# EAGLE design Laser_Teensy4 (EAGLE 9.6.2)

## Sheet 1 of 2
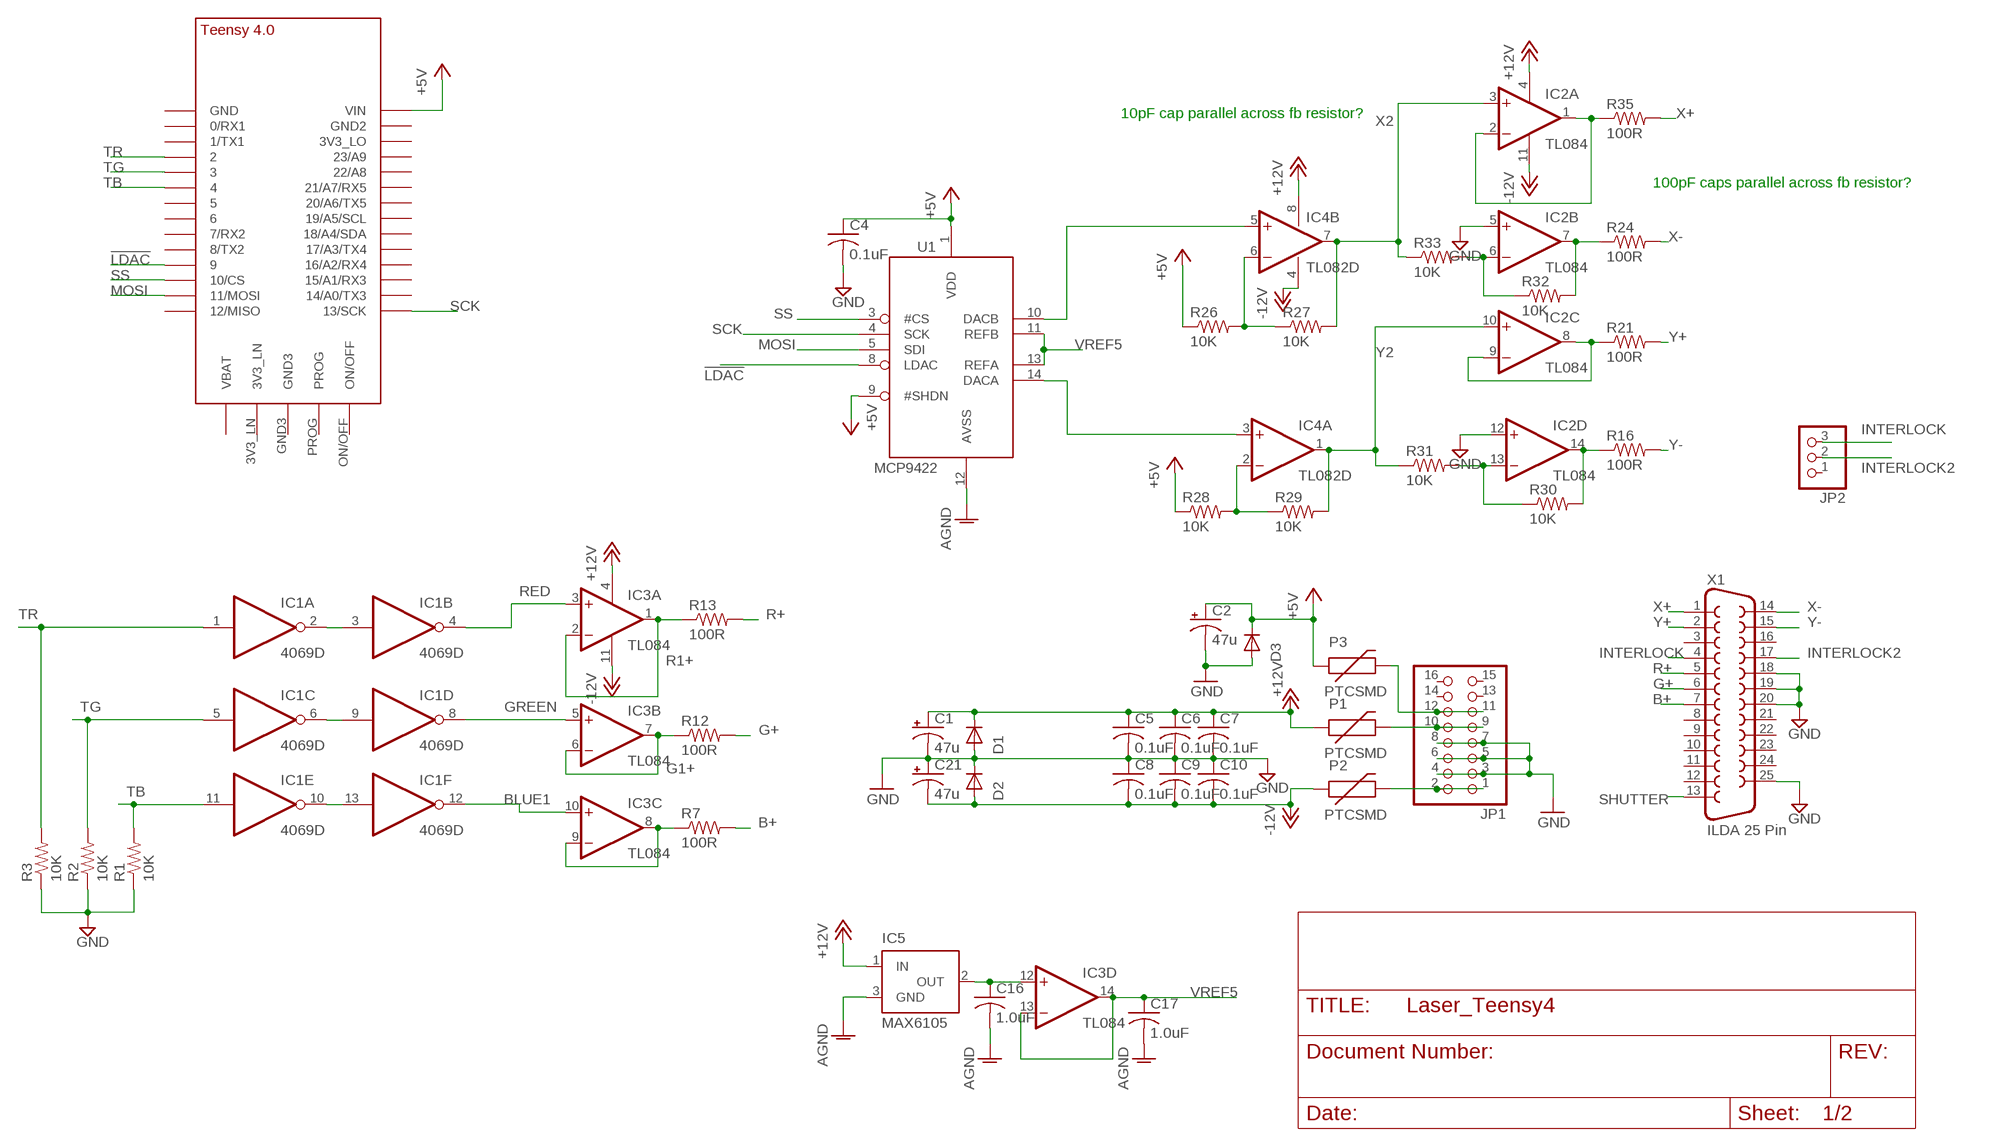
[diagram p0: schematic, sheet 1]

### Parts
C1  47u  CPOL-USD  [PANASONIC_D]
C2  47u  CPOL-USD  [PANASONIC_D]
C4  0.1uF  C-USC0603  [C0603]
C5  0.1uF  C-USC0603  [C0603]
C6  0.1uF  C-USC0603  [C0603]
C7  0.1uF  C-USC0603  [C0603]
C8  0.1uF  C-USC0603  [C0603]
C9  0.1uF  C-USC0603  [C0603]
C10  0.1uF  C-USC0603  [C0603]
C16  1.0uF  C-US025-024X044  [C025-024X044]
C17  1.0uF  C-US025-024X044  [C025-024X044]
C21  47u  CPOL-USD  [PANASONIC_D]
D1  1N5819HW  DIODE-SOD123  [SOD123]
D2  1N5819HW  DIODE-SOD123  [SOD123]
D3  1N5819HW  DIODE-SOD123  [SOD123]
IC1  4069D  [SO14]
IC2  TL084  [SOIC-14]
IC3  TL084  [SOIC-14]
IC4  TL082D  [SO08]
IC5  MAX6105  MAX6520  [SOT23]
JP1  PINHD-2X8  [2X08]
JP2  PINHD-1X3  [1X03]
P1  PTCSMD  [PTC-1206]
P2  PTCSMD  [PTC-1206]
P3  PTCSMD  [PTC-1206]
R1  10K  R-US_R0603  [R0603]
R2  10K  R-US_R0603  [R0603]
R3  10K  R-US_R0603  [R0603]
R7  100R  R-US_R0603  [R0603]
R12  100R  R-US_R0603  [R0603]
R13  100R  R-US_R0603  [R0603]
R16  100R  R-US_R0603  [R0603]
R21  100R  R-US_R0603  [R0603]
R24  100R  R-US_R0603  [R0603]
R26  10K  R-US_R0603  [R0603]
R27  10K  R-US_R0603  [R0603]
R28  10K  R-US_R0603  [R0603]
R29  10K  R-US_R0603  [R0603]
R30  10K  R-US_R0603  [R0603]
R31  10K  R-US_R0603  [R0603]
R32  10K  R-US_R0603  [R0603]
R33  10K  R-US_R0603  [R0603]
R35  100R  R-US_R0603  [R0603]
U1  MCP4922  [SOIC-14]
U$1  TEENSY_4.0  [TEENSY_4.0]
X1  ILDA 25 Pin  F25D  [F25D]

### Nets
!LDAC: U1.8(LDAC) U$1.9/CS
+5V [power]: C2.+ C4.1 D3.C P3.1 R26.1 R28.1 U1.1(VDD) U1.9(#SHDN) U$1.VIN
+12V [power]: C1.+ C5.1 C6.1 C7.1 D1.C IC2.4(A:V+) IC3.4(A:V+) IC4.8(P:V+) IC5.1(IN) P1.1
-12V [power]: C8.2 C9.2 C10.2 C21.- D2.A IC2.11(A:V-) IC3.11(A:V-) IC4.4(P:V-) P2.1
AGND: C16.2 C17.2 IC5.3(GND) U1.12(AVSS)
B1+: IC3.8(C:OUT) IC3.9(C:-IN) R7.1
B+: R7.2 X1.7
BLUE1: IC1.12(F:O) IC3.10(C:+IN)
G1+: IC3.6(B:-IN) IC3.7(B:OUT) R12.1
G+: R12.2 X1.6
GND: C1.- C2.- C4.2 C5.2 C6.2 C7.2 C8.1 C9.1 C10.1 C21.+ D1.A D2.C D3.A IC2.5(B:+IN) IC2.12(D:+IN) JP1.3 JP1.4 JP1.5 JP1.6 JP1.7 JP1.8 R1.1 R2.1 R3.1 X1.18 X1.19 X1.20 X1.25 ; also sheet 2
GREEN: IC1.8(D:O) IC3.5(B:+IN)
INTERLOCK: JP2.3 X1.4
INTERLOCK2: JP2.2 X1.17
MOSI: U1.5(SDI) U$1.11/MOSI
N$1: IC1.2(A:O) IC1.3(B:I)
N$2: IC1.6(C:O) IC1.9(D:I)
N$3: IC1.10(E:O) IC1.13(F:I)
N$7: JP1.1 JP1.2 P2.2
N$8: JP1.9 JP1.10 P1.2
N$10: JP1.11 JP1.12 P3.2
N$24: IC4.5(B:+IN) U1.10(DACB)
N$25: C16.1 IC3.12(D:+IN) IC5.2(OUT)
N$30: IC4.6(B:-IN) R26.2 R27.1
N$31: IC4.2(A:-IN) R28.2 R29.1
N$33: IC4.3(A:+IN) U1.14(DACA)
N$35: IC2.6(B:-IN) R32.1 R33.2
N$36: IC2.13(D:-IN) R30.1 R31.2
R1+: IC3.1(A:OUT) IC3.2(A:-IN) R13.1
R+: R13.2 X1.5
RED: IC1.4(B:O) IC3.3(A:+IN)
SCK: U1.4(SCK) U$1.13/SCK
SHUTTER: X1.13
SS: U1.3(#CS) U$1.10/CS
TB: IC1.11(E:I) R1.2 U$1.4/CANRX
TG: IC1.5(C:I) R2.2 U$1.3/CANTX
TR: IC1.1(A:I) R3.2 U$1.2
VREF5 [power]: C17.1 IC3.13(D:-IN) IC3.14(D:OUT) U1.11(REFB) U1.13(REFA)
X1+: IC2.1(A:OUT) IC2.2(A:-IN) R35.1
X1-: IC2.7(B:OUT) R24.1 R32.2
X2: IC2.3(A:+IN) IC4.7(B:OUT) R27.2 R33.1
X+: R35.2 X1.1
X-: R24.2 X1.14
Y1+: IC2.8(C:OUT) IC2.9(C:-IN) R21.1
Y1-: IC2.14(D:OUT) R16.1 R30.2
Y2: IC2.10(C:+IN) IC4.1(A:OUT) R29.2 R31.1
Y+: R21.2 X1.2
Y-: R16.2 X1.15
Unconnected: JP1.13 JP1.14 JP1.15 JP1.16 JP2.1 U$1.0/RX(0/RX1) U$1.1/TX(1/TX1) U$1.3V3_LN U$1.3V3_LO U$1.5 U$1.6 U$1.7(7/RX2) U$1.8(8/TX2) U$1.12/MISO U$1.14/A0(14/A0/TX3) U$1.15/A1(15/A1/RX3) U$1.16/A2(16/A2/RX4) U$1.17/A3(17/A3/TX4) U$1.18/A4/SDA U$1.19/A5/SCL U$1.20/A6(20/A6/TX5) U$1.21/A7(21/A7/RX5) U$1.22/A8 U$1.23/A9 U$1.GND U$1.GND2 U$1.GND3 U$1.ON/OFF U$1.PROG U$1.VBAT\(VBAT) X1.3 X1.8 X1.9 X1.10 X1.11 X1.12 X1.16 X1.21 X1.22 X1.23 X1.24

### Notes on the sheet
- 10pF cap parallel across fb resistor?
- 100pF caps parallel across fb resistor?

## Sheet 2 of 2
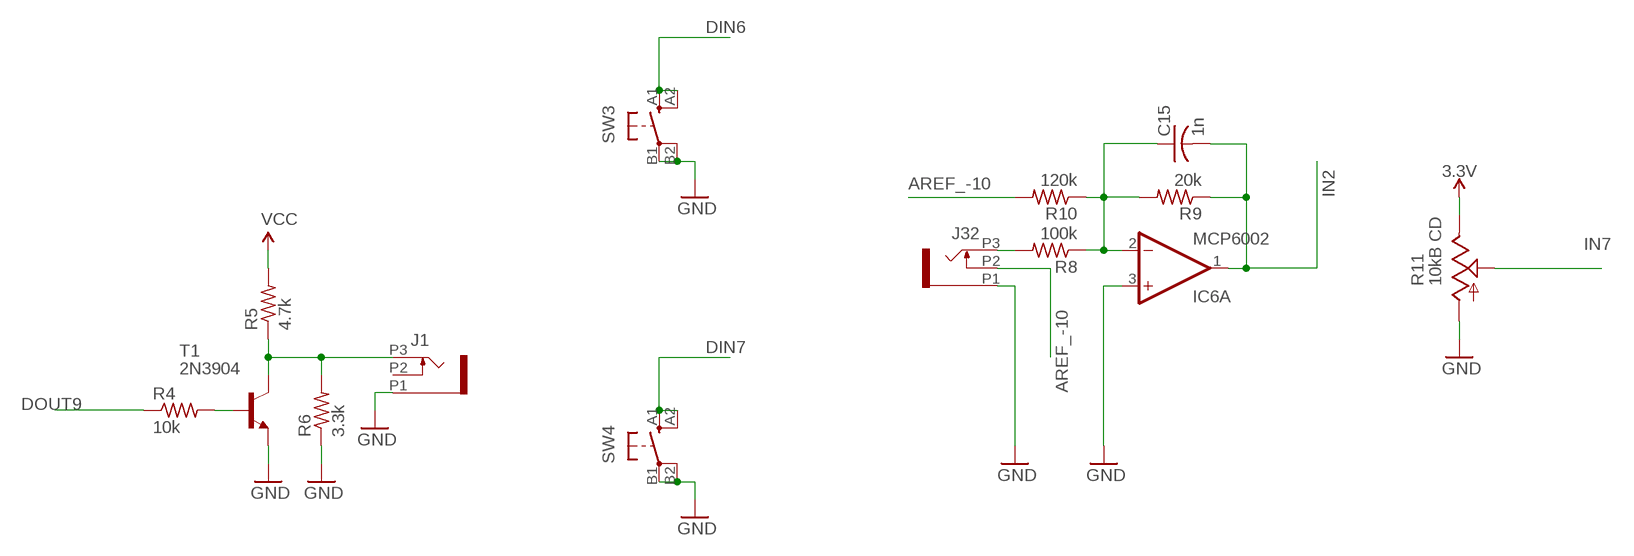
[diagram p1: schematic, sheet 2]

### Parts
C15  1n  C-US050-025X075  [C050-025X075]
IC6  MCP6002  TL072D  [SO08]
J1  PJ301_THONKICONN6  [WQP_PJ_301M6]
J32  PJ301_THONKICONN6  [WQP_PJ_301M6]
R4  10k  R-US_0204/7  [0204/7]
R5  4.7k  R-US_0204/7  [0204/7]
R6  3.3k  R-US_0204/7  [0204/7]
R8  100k  R-US_0204/7  [0204/7]
R9  20k  R-US_0204/7  [0204/7]
R10  120k  R-US_0204/7  [0204/7]
R11  10kB CD  POT_USVERTICAL_PS  [ALPS_POT_VERTICAL_PS]
SW3  D6R  [D6R]
SW4  D6R  [D6R]
T1  2N3904  [TO92]

### Nets
3.3V [+3V3]: R11.P$1(E)
AREF_-10 [-10V]: J32.P2 R10.2
DIN6: SW3.A1(S) SW3.A2(S1)
DIN7: SW4.A1(S) SW4.A2(S1)
DOUT9: R4.1
GND: IC6.3(A:+IN) J1.P1 J32.P1 R6.1 R11.P$3(A) SW3.B1(P) SW3.B2(P1) SW4.B1(P) SW4.B2(P1) T1.3(E) ; also sheet 1
IN2: C15.2 IC6.1(A:OUT) R9.1
IN7: R11.P$2(S)
N$4: R4.2 T1.2(B)
N$5: J1.P3 R5.1 R6.2 T1.1(C)
N$6: C15.1 IC6.2(A:-IN) R8.1 R9.2 R10.1
N$34: J32.P3 R8.2
VCC [VCC]: R5.2
Unconnected: IC6.5(B:+IN) IC6.6(B:-IN) IC6.7(B:OUT) J1.P2

## Power pins joined to a net without a drawn wire
+5V: IC1.14(P:VDD)
V+: IC6.8(P:V+)
V-: IC6.4(P:V-)
VSS: IC1.7(P:VSS)

## Library data of the parts
C1 C2 C21 = rcl:CPOL-US: POLARIZED CAPACITOR, American symbol
C4-C10 C16 C17 = adafruit:C-US: CAPACITOR, American symbol
C15 = rcl:C-US: CAPACITOR, American symbol; SPICEPREFIX: C
D1-D3 = diode:DIODE-: DIODE
IC1 = 40xx:4069: Hex INVERTER
IC2 IC3 = favreau:TL084: Texas Instruments TL084 JFET General Purpose Op-Amp
IC4 = linear:TL082: OP AMP
IC5 = maxim:MAX6520: 1.2V Voltage Reference 50ppm/°C, SOT23, 3-Terminal Source: http://datasheets.maxim-ic.com/en/ds/MAX6520.pdf
IC6 = linear:TL072: OP AMP
J1 J32 = og-pj301_variations:PJ301_THONKICONN
JP1 = pinhead:PINHD-2X8: PIN HEADER
JP2 = pinhead:PINHD-1X3: PIN HEADER
P1-P3 = SparkFun:PTC: Resettable Fuse PTC Resettable Fuse. Spark Fun Electronics SKU : COM-08357
R1-R3 R7 R12 R13 R16 R21 R24 R26-R33 R35 = resistor:R-US_: RESISTOR, American symbol
R4-R6 R8-R10 = rcl:R-US_: RESISTOR, American symbol; SPICEPREFIX: R
R11 = pot-alps:POT_US
SW3 SW4 = og-switch:D6R: C&K D6R
T1 = transistor:2N3904: NPN TRANSISTOR
U1 = favreau:MCP4922
U$1 = TEENSY 4.0:TEENSY_4.0
X1 = SparkFun:F25: D-SUB 25 25 Pin male connector. PCB edge mount for regular PCB thicknesses. This connector will connect directly to the back of a PC parallel port or through a normal DB25 extension cable (M/F). SKU: PRT-08287

## Net classes
0 default: width 0.203 mm, clearance 0.203 mm
1 power: width 0.305 mm, clearance 0.203 mm
2 +3V3: width 0.356 mm, clearance 0.152 mm to class 0, clearance 0.254 mm
3 -10V: width 0.356 mm, clearance 0.152 mm to class 0, clearance 0.254 mm
4 VCC: width 0.457 mm, clearance 0.152 mm to class 0, clearance 0.254 mm

## Board
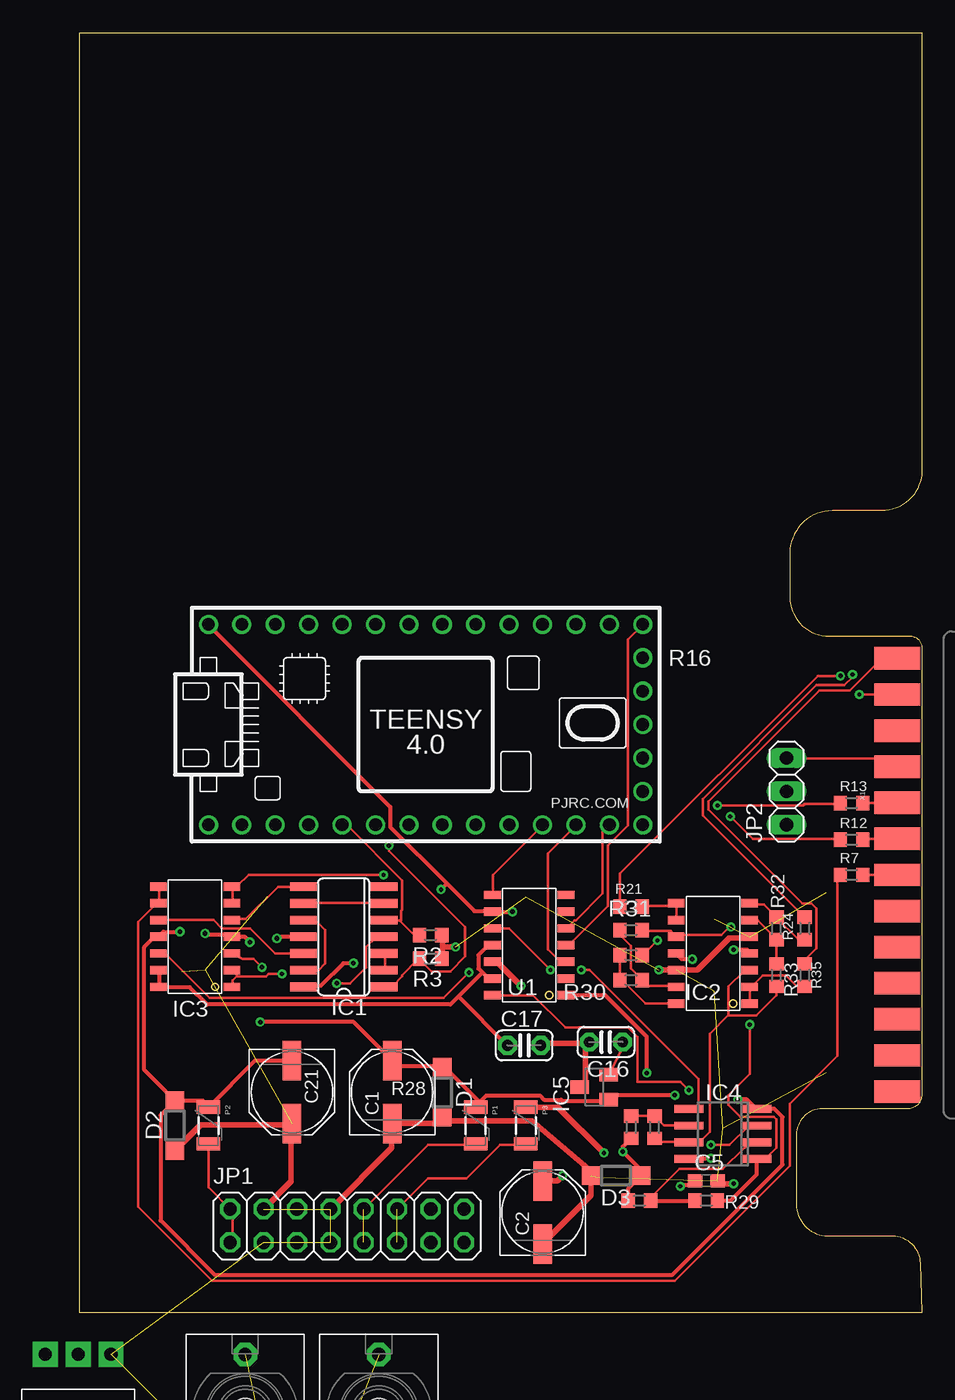
[diagram p2: board, top side]
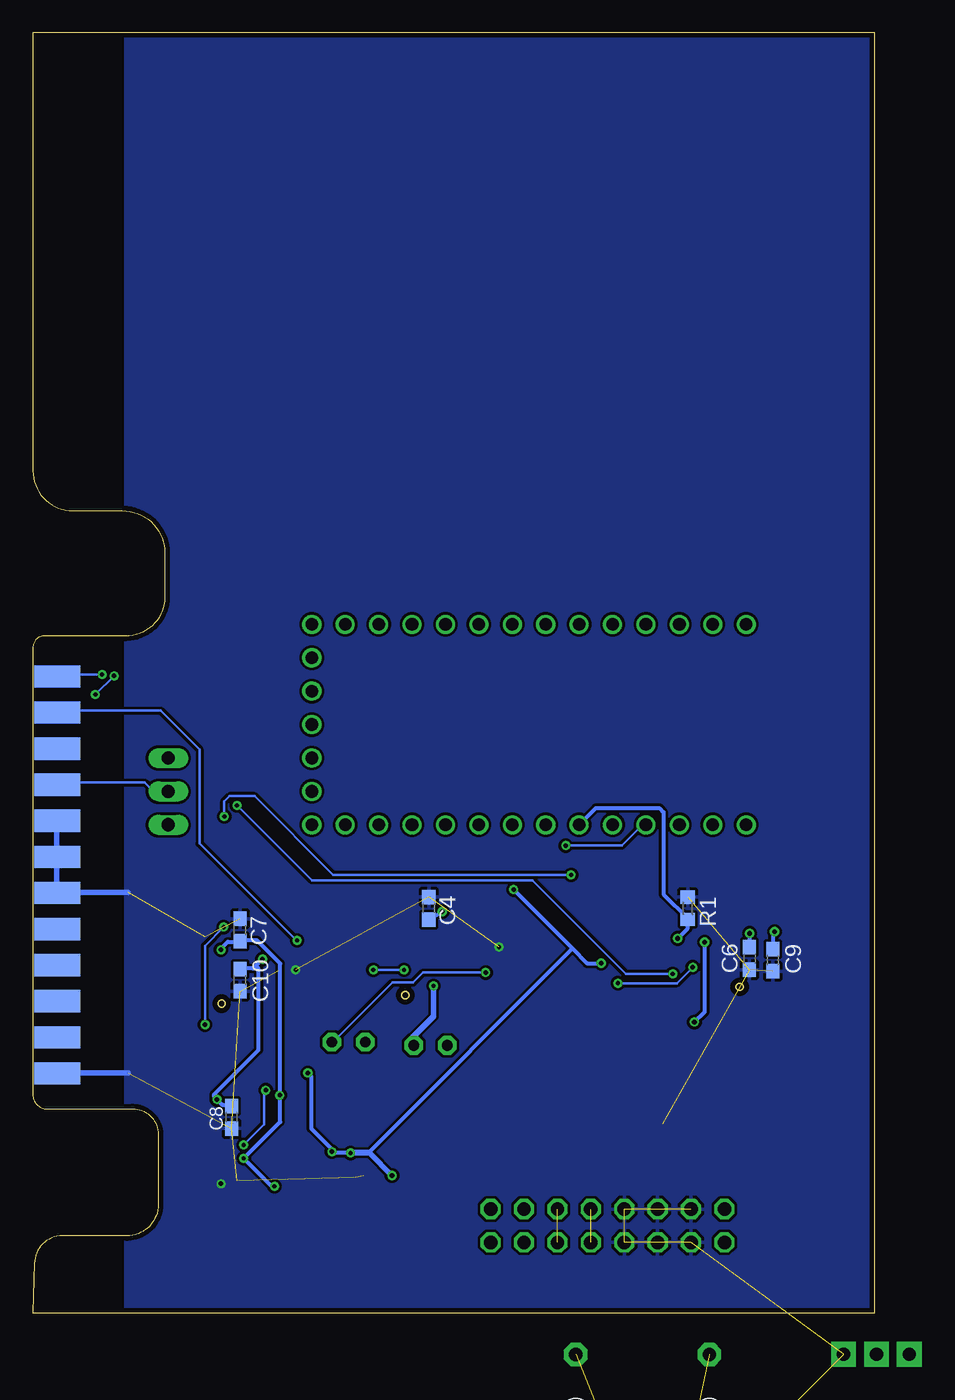
[diagram p3: board, bottom side, seen from below]

Size 64.01 x 97.28 mm. Coordinates in mm from the lower left corner, seen from the top.
Outline: 0,97.28 64.01,97.28 64.01,63.99 arc-90 60.97,60.96 57.2,60.96 arc90 53.97,57.73 53.97,54.42 arc90 56.96,51.44 63.14,51.44 arc-90 64.01,50.57 64.01,16.57 arc-90 62.93,15.49 56.43,15.49 arc90 54.48,13.55 54.48,8.22 arc90 56.86,5.84 61.78,5.84 arc-90 63.89,3.74 64.01,0 0,0 0,97.28
Copper layers (1*16): Top 0.0356mm / dielectric 1.5011mm / Bottom 0.0356mm
Design rules "LaenPCBOrder": minimum track width 6mil, minimum drill 13mil, track to track 6mil, track to pad 6mil, pad to pad 6mil, via to via 6mil, smd to smd 6mil, copper to edge 15mil, drill to drill 6mil, minimum pad ring 7mil, minimum via ring 7mil, stop-mask expansion 4mil, vias tented up to drill 0mil, thermal gap 10mil

### Footprints (pad centres in the part's own frame; a part is rotated, then mirrored left to right if it is on the bottom)
PANASONIC_D = smd 3 x 1.4: + 2.4,0; - -2.4,0
C0603 = smd 1.1 x 1: 1 -0.85,0; 2 0.85,0
C050-025X075 = drill 0.813 octagon: 1 -2.54,0; 2 2.54,0
C025-024X044 = drill 0.813 pad 1.422 octagon: 1 -1.27,0; 2 1.27,0
SOD123 = smd 1.4 x 1.4: A 1.9,0; C -1.9,0
SO14 = smd 0.66 x 2.032: 1 -3.81,-3.073; 2 -2.54,-3.073; 3 -1.27,-3.073; 4 0,-3.073; 5 1.27,-3.073; 6 2.54,-3.073; 7 3.81,-3.073; 8 3.81,3.073; 9 2.54,3.073; 10 1.27,3.073; 11 0,3.073; 12 -1.27,3.073; 13 -2.54,3.073; 14 -3.81,3.073
SOIC-14 = smd 1.27 x 0.635: 1 -0.762,-0.508; 2 -0.762,-1.778; 3 -0.762,-3.048; 4 -0.762,-4.318; 5 -0.762,-5.588; 6 -0.762,-6.858; 7 -0.762,-8.128; 8 4.826,-8.128; 9 4.826,-6.858; 10 4.826,-5.588; 11 4.826,-4.318; 12 4.826,-3.048; 13 4.826,-1.778; 14 4.826,-0.508
SO08 = smd 0.6 x 2.2: 1 -1.905,-2.6; 2 -0.635,-2.6; 3 0.635,-2.6; 4 1.905,-2.6; 5 1.905,2.6; 6 0.635,2.6; 7 -0.635,2.6; 8 -1.905,2.6
SOT23 = smd 1 x 1.4: 1 -0.95,-1.1; 2 0.95,-1.1; 3 0,1.1
WQP_PJ_301M6 = drill 1.016 pad 1.778 octagon: P1 0,-5.715; P2 0,-3.175; P3 0,4.445 | hole 2.2: 0,0
2X08 = drill 1.016 octagon: 1 -8.89,-1.27; 2 -8.89,1.27; 3 -6.35,-1.27; 4 -6.35,1.27; 5 -3.81,-1.27; 6 -3.81,1.27; 7 -1.27,-1.27; 8 -1.27,1.27; 9 1.27,-1.27; 10 1.27,1.27; 11 3.81,-1.27; 12 3.81,1.27; 13 6.35,-1.27; 14 6.35,1.27; 15 8.89,-1.27; 16 8.89,1.27
1X03 = drill 1.016 long: 1 -2.54,0; 2 0,0; 3 2.54,0
PTC-1206 = smd 1 x 1.8: 1 -1.4,0; 2 1.4,0
R0603 = smd 1 x 1.1: 1 -0.85,0; 2 0.85,0
0204/7 = drill 0.813 octagon: 1 -3.81,0; 2 3.81,0
ALPS_POT_VERTICAL_PS = drill 1 pad 1.88 square: P$1 -2.5,7; P$2 0,7; P$3 2.5,7 | drill 1.5 pad 2.54 octagon: P$4 -4.7,0; P$5 4.7,0
D6R = drill 1.1 pad 1.93: A1 -2.5,2.5; A2 2.5,2.5; B1 -2.5,-2.5; B2 2.5,-2.5
TO92 = drill 0.813 octagon: 1 1.27,0; 2 0,1.905; 3 -1.27,0
TEENSY_4.0 = drill 0.965: 0/RX -13.97,-7.62; 1/TX -11.43,-7.62; 2 -8.89,-7.62; 3/CANTX -6.35,-7.62; 3V3_LN 16.51,-2.54; 3V3_LO -11.43,7.62; 4/CANRX -3.81,-7.62; 5 -1.27,-7.62; 6 1.27,-7.62; 7 3.81,-7.62; 8 6.35,-7.62; 9/CS 8.89,-7.62; 10/CS 11.43,-7.62; 11/MOSI 13.97,-7.62; 12/MISO 16.51,-7.62; 13/SCK 16.51,7.62; 14/A0 13.97,7.62; 15/A1 11.43,7.62; 16/A2 8.89,7.62; 17/A3 6.35,7.62; 18/A4/SDA 3.81,7.62; 19/A5/SCL 1.27,7.62; 20/A6 -1.27,7.62; 21/A7 -3.81,7.62; 22/A8 -6.35,7.62; 23/A9 -8.89,7.62; GND -16.51,-7.62; GND2 -13.97,7.62; GND3 16.51,0; ON/OFF 16.51,5.08; PROG 16.51,2.54; VBAT\ 16.51,-5.08; VIN -16.51,7.62
F25D = smd 1.7 x 3.5: 1 -16.459,-6.045; 2 -13.716,-6.045; 3 -10.973,-6.045; 4 -8.23,-6.045; 5 -5.486,-6.045; 6 -2.743,-6.045; 7 0,-6.045; 8 2.743,-6.045; 9 5.486,-6.045; 10 8.23,-6.045; 11 10.973,-6.045; 12 13.716,-6.045; 13 16.459,-6.045 | smd 1.7 x 3.5 bottom: 14 -15.088,-6.045; 15 -12.344,-6.045; 16 -9.601,-6.045; 17 -6.858,-6.045; 18 -4.115,-6.045; 19 -1.372,-6.045; 20 1.372,-6.045; 21 4.115,-6.045; 22 6.858,-6.045; 23 9.601,-6.045; 24 12.344,-6.045; 25 15.088,-6.045

### Placement (x,y rotation side)
C1  23.75,16.76 90 top
C2  35.18,7.62 90 top
C4  33.91,30.73 90 bottom
C5  47.62,10.03 0 top
C6  9.52,26.92 270 bottom
C7  48.26,29.08 90 bottom
C8  48.89,14.86 90 bottom
C9  7.75,26.8 90 bottom
C10  48.26,25.27 90 bottom
C15  10.03,-33.02 0 top  (outside the outline)
C16  40,20.57 180 top
C17  33.78,20.32 0 top
C21  16.13,16.76 270 top
D1  27.56,16.76 270 top
D2  7.24,14.22 90 top
D3  40.77,10.41 180 top
IC1  20.07,28.58 90 top
IC2  50.16,22.99 180 top
IC3  10.79,24.26 180 top
IC4  48.89,13.59 90 top
IC5  39.12,17.14 90 top
IC6  -0.13,-38.1 0 top  (outside the outline)
J1  12.57,-7.62 0 top  (outside the outline)
J32  22.73,-7.62 0 top  (outside the outline)
JP1  20.32,6.6 0 top
JP2  53.72,39.62 90 top
P1  30.1,14.22 270 top
P2  9.78,14.22 270 top
P3  33.91,14.22 270 top
R1  14.22,30.73 270 bottom
R2  26.67,28.7 180 top
R3  26.67,26.92 180 top
R4  -0.13,-45.72 0 top  (outside the outline)
R5  10.03,-45.72 0 top  (outside the outline)
R6  20.19,-45.72 0 top  (outside the outline)
R7  58.67,33.27 0 top
R8  -0.13,-50.8 0 top  (outside the outline)
R9  10.03,-50.8 0 top  (outside the outline)
R10  20.19,-50.8 0 top  (outside the outline)
R11  -0.13,-10.16 0 top  (outside the outline)
R12  58.67,35.94 0 top
R13  58.67,38.73 0 top
R16  41.91,27.18 0 top
R21  41.91,30.86 180 top
R24  55.12,29.21 90 top
R26  41.91,14.1 90 top
R27  43.69,14.1 270 top
R28  42.54,8.51 0 top
R29  47.62,8.51 0 top
R30  41.91,25.27 180 top
R31  41.91,29.08 180 top
R32  52.96,29.21 90 top
R33  52.96,25.65 90 top
R35  55.12,25.65 90 top
SW3  2.41,-22.86 0 top  (outside the outline)
SW4  17.65,-22.86 0 top  (outside the outline)
T1  17.65,-33.02 0 top  (outside the outline)
U1  36.2,23.62 180 top
U$1  26.29,44.7 0 top
X1  68.2,33.27 270 top

### Tracks (layer width: path | path; a pad name or v marks a point on that pad's centre or on a via)
!LDAC
  Top 0.203: U1.8 31.42,31.75 31.42,33.27 35.18,37.03 U$1.9/CS
+5V  (via drill 0.33, 0.35)
  Top 0.305: 41.51,8.69 R28.1 41.7,9.44 D3.C 42.67,10.85 v41.27,12.24 41.27,12.61 R26.1 | U1.1 39.95,24.13 43.1,20.98 v43.1,18.21 | 33.96,15.6 P3.1 | 27.92,32.61 23.6,36.93 23.6,38.46 9.78,52.27 U$1.VIN | 27.92,32.61 30,30.53 31.32,30.53 U1.9 v32.89,30.48 | v20.8,26.57 20.04,26.57 18.31,24.84 16.99,24.84 IC1.14 | 27.92,32.61 v27.46,32.16
  Top 0.406: v36.7,10.41 36.31,10.02 C2.+ | P3.1 36.37,15.62 v39.85,12.14
  Bottom 0.305: v43.1,18.21 42.85,17.96 42.85,14.02 41.17,12.34 v41.27,12.24 41.17,12.14 v39.85,12.14 39.75,12.24 38.43,12.24 22.99,27.69 | v20.8,26.57 21.87,26.57 22.99,27.69 | v27.46,32.16 22.99,27.69 | v32.89,30.48 C4.1
  Bottom 0.406: v39.85,12.14 38.43,12.14 v36.7,10.41
+12V  (via drill 0.33, 0.35)
  Top 0.305: v49.71,27.58 50.72,27.58 50.93,27.38 IC2.4 | v45.64,9.6 45.74,9.7 46.72,9.7 C5.1 | v47.98,11.73 46.35,11.73 IC4.8 | v45.24,16.54 40.56,16.54 IC5.1 40.13,16.1 36.68,16.1 36.6,16.18 35.3,16.18 34.98,16.51 30.91,16.51 30.1,15.7 P1.1 30.3,16.1 27.66,18.75 D1.C 27.56,18.75 24.21,18.75 23.8,19.15 C1.+ 20.82,22.1 v13.72,22.1 | v9.52,28.83 9.65,28.7 11.43,28.7 IC3.4 11.6,28.62 11.66,28.55 12.55,28.55 v12.93,28.17
  Bottom 0.305: v49.71,27.58 49.71,27.69 49.2,28.19 48.28,28.19 C7.1 48.18,28.3 46.96,28.3 45.21,26.54 45.21,16.51 | v45.64,9.6 45.85,9.6 v47.98,11.73 45.21,14.5 45.21,16.51 | v45.24,16.54 45.21,16.51 | v9.52,28.83 C6.1 | v13.72,22.1 12.93,22.88 v12.93,28.17
-12V  (via drill 0.33, 0.35)
  Top 0.305: v46.56,26.87 45.74,26.87 45.34,27.28 IC2.11 | v50.01,16.2 50.72,16.2 51.43,15.49 IC4.4 52.79,15.49 53.42,14.87 53.42,11.24 45.07,2.9 10.25,2.9 6.13,7.01 6.13,15.02 D2.A | D2.A 7.24,16.1 9.37,16.1 9.78,15.7 P2.1 13.32,19.16 C21.- | D2.A 7.14,16.2 4.9,18.44 4.9,27.79 5.51,28.4 5.92,28.4 IC3.11 6.35,28.96 v7.62,28.96
  Bottom 0.305: v46.56,26.87 47.07,26.37 | 47.07,26.37 47.27,26.16 48.18,26.16 C10.2 | C8.2 48.89,15.8 49.61,15.8 v50.01,16.2 50.22,16.41 50.22,16.61 46.86,19.96 46.86,26.16 47.07,26.37 | v7.62,28.96 7.75,28.83 C9.2
AGND  (via drill 0.33)
  Top 0.406: IC5.3 38.46,17.14 38.46,20.3 C16.2 38.63,20.47 35.18,20.47 35.08,20.37 C17.2 | U1.12 31.73,26.67 v33.55,24.84
  Bottom 0.406: v33.55,24.84 33.55,22.5 35.18,20.88 35.18,20.47 35.08,20.37 C17.2
AREF_-10  (1 unrouted)
B1+
  Top 0.203: IC3.8 6.02,32.36 6.02,31.14 IC3.9 5.89,31.04 5.78,31.04 4.45,29.7 4.45,8.05 10.06,2.44 45.26,2.44 53.97,11.15 53.97,15.88 57.61,19.51 57.61,33.06 R7.1
B+
  Top 0.203: X1.7 R7.2
BLUE1
  Top 0.203: IC3.10 10.17,29.84 10.8,29.22 12.94,29.22 14.86,27.3 IC1.12
DIN6  (1 unrouted)
DIN7  (1 unrouted)
G1+  (via drill 0.33)
  Top 0.203: v49.45,37.72 51.16,36.02 57.73,36.02 R12.1 | v23.09,33.27 12.83,33.27 12.01,32.46 11.61,32.46 IC3.7 11.61,32.36 11.61,31.14 IC3.6
  Bottom 0.203: v49.45,37.72 49.45,38.86 49.05,39.27 47.17,39.27 41.17,33.27 v23.09,33.27
G+
  Top 0.203: R12.2 59.56,36.02 62.1,36.02 X1.6
GND  (via drill 0.33)  (28 unrouted)
  Top 0.406: 39.45,10.29 34.37,14.58 27.76,14.58 27.56,14.78 D1.A 27.46,14.68 27.15,14.38 23.8,14.38 C1.- 23.7,14.17 23.7,12.52 JP1.8 | D2.C 7.24,12.34 9.17,14.28 16.08,14.28 C21.+ 16.08,14.07 16.08,9.98 JP1.4 | IC2.5 50.93,28.5 49.4,28.5 46.96,26.06 45.34,26.06 IC2.12 45.24,26.06 v44.02,26.06 | 27.56,27.79 27.56,28.7 R2.1 | 27.56,27.79 27.56,26.98 R3.1 | v49.71,9.8 48.6,9.8 C5.2 | v28.58,27.79 27.56,27.79 | C2.- 38.87,8.91 D3.A
  Bottom 0.406: X1.18 62.2,37.34 62.2,34.8 X1.19 62.2,34.59 62.2,31.95 X1.20 62,31.95 56.77,31.95 | 56.77,18.24 62.1,18.24 X1.25
  pour Bottom: -1.4,99.06 57.02,99.06 57.02,-1.27 -1.4,-1.27
GREEN
  Top 0.203: IC3.5 11.61,29.92 12.62,29.92 15.06,32.36 16.99,32.36 IC1.8
IN2  (2 unrouted)
INTERLOCK
  Top 0.203: JP2.3 53.77,42.11 61.59,42.11 62.1,41.61 X1.4
INTERLOCK2
  Bottom 0.203: X1.17 62,40.28 55.5,40.28 54.89,39.67 53.77,39.67 JP2.2
MOSI
  Top 0.203: U1.5 37.01,29.21 37.62,29.82 37.72,29.82 39.75,31.85 39.75,36.52 40.26,37.03 U$1.11/MOSI
N$1
  Top 0.203: IC1.2 23.19,26.06 23.19,27.28 IC1.3
N$2
  Top 0.203: IC1.9 16.99,31.14 23.09,31.14 IC1.6
N$3
  Top 0.203: IC1.10 17.88,29.84 18.64,29.08 18.64,26.54 18.14,26.04 IC1.13
N$4  (1 unrouted)
N$5  (3 unrouted)
N$6  (4 unrouted)
N$7
  Top 0.203: P2.2 9.78,9.53 JP1.2 11.61,7.87 11.61,5.51 JP1.1
N$8  (1 unrouted)
  Top 0.203: JP1.10 26.47,12.75 30.1,12.75 P1.2
N$10  (1 unrouted)
  Top 0.203: JP1.12 26.47,10.21 29.39,10.21 31.93,12.75 33.86,12.75 P3.2
N$24  (via drill 0.33)
  Top 0.203: U1.10 32.64,29.21 v35.79,26.06 | v38.12,26.06 38.73,26.06 47.02,17.78 47.02,15.58 46.93,15.49 IC4.5
  Bottom 0.203: v38.12,26.06 v35.79,26.06
N$25  (via drill 0.33)
  Top 0.203: v29.59,25.86 27.66,23.93 9.88,23.93 6.53,27.28 6.02,27.28 IC3.12 | C16.1 41.4,20.45 IC5.2
  Bottom 0.203: v29.59,25.86 34.34,25.86 35.1,25.09 36.65,25.09 41.17,20.57 C16.1
N$30
  Top 0.203: R27.1 43.69,14.93 44.39,14.22 IC4.6 | 43.27,14.95 R27.1 | R27.1 R26.2
N$31
  Top 0.203: IC4.2 50.99,12.95 50.58,12.54 50.52,12.54 48.9,10.92 45.59,10.92 43.39,8.72 R28.2
  Top 0.305: R28.2 R29.1
N$33  (via drill 0.33)
  Top 0.203: U1.14 34.47,24.13 36.91,21.69 41.68,21.69 42.39,20.98 42.39,17.55 45.67,17.55 v46.3,16.92 | v47.98,12.75 49.4,12.75 50.82,14.17 51.43,14.17 IC4.3
  Bottom 0.203: v46.3,16.92 46.43,16.92 46.43,14.3 v47.98,12.75
N$34  (1 unrouted)
N$35
  Top 0.203: R33.2 R32.1 52.96,28.4 51.54,29.82 50.93,29.82 IC2.6
N$36
  Top 0.203: R31.2 41.07,29.01 41.07,28.7 41.88,27.89 41.88,26.16 42.7,25.35 R30.1 42.8,25.25 43.2,24.84 45.34,24.84 IC2.13
R1+  (via drill 0.33)
  Top 0.203: v48.49,38.56 54.99,38.56 55.09,38.66 57.73,38.66 R13.1 | v15.37,25.76 14.35,25.76 14.15,25.55 12.01,25.55 11.96,25.6 | 11.96,25.6 11.61,25.96 IC3.2 | 11.96,25.6 11.61,25.25 11.61,24.84 IC3.1
  Bottom 0.203: v48.49,38.56 42.8,32.87 26.04,32.87 18.92,25.76 v15.37,25.76
R+
  Top 0.203: R13.2 59.56,38.76 62.1,38.76 X1.5
RED  (via drill 0.33)
  Top 0.203: v13.84,26.26 13.21,26.9 12.37,26.9 IC3.3 | v19.53,25.04 20.55,25.04 21.77,26.26 21.77,27.79 22.48,28.5 23.09,28.5 IC1.4
  Bottom 0.203: v13.84,26.26 15.06,25.04 v19.53,25.04
SCK
  Top 0.203: U1.4 37.01,27.99 37.21,27.99 40.16,30.94 40.16,35.51 41.68,37.03 41.68,51.16 42.8,52.27 U$1.13/SCK
SS
  Top 0.203: U1.3 36.55,26.67 35.61,27.61 35.61,34.92 37.72,37.03 U$1.10/CS
TB  (via drill 0.35)
  Top 0.305: IC1.11 15.11,28.58 v14.99,28.45
  Bottom 0.305: U$1.4/CANRX 21.21,38.35 16.38,38.35 16.07,38.04 16.07,31.8 14.22,29.96 R1.2 14.22,29.21 v14.99,28.45
TG
  Top 0.203: R2.2 25.43,28.7 24.36,29.77 | 24.36,29.77 24.31,29.82 23.19,29.82 IC1.5 | 24.36,29.77 24.41,29.82 24.41,30.53 24.51,30.63 24.51,32.87 20.35,37.03 19.94,37.03 U$1.3/CANTX
TR  (via drill 0.33)
  Top 0.203: IC1.1 23.19,24.84 23.8,24.84 24.51,25.55 24.51,25.65 25.73,26.87 R3.2 25.83,26.87 26.75,25.96 28.17,25.96 29.29,27.08 29.29,29.31 23.5,35.1 v23.5,35.51
  Bottom 0.203: v23.5,35.51 19.23,35.51 17.7,37.03 17.4,37.03 U$1.2
VREF5
  Top 0.305: IC3.13 6.02,25.96 6.02,24.84 IC3.14 6.12,24.74 8.36,24.74 9.68,23.42 28.17,23.42 28.78,24.03 | 30.61,25.86 30.3,26.16 30.3,27.18 31.01,27.89 31.32,27.89 U1.11 | 30.61,25.86 31.01,25.45 31.32,25.45 U1.13 | 30.61,25.86 28.78,24.03 | 28.78,24.03 32.44,20.37 C17.1
X1+
  Top 0.203: R35.1 55.09,24.84 54.48,24.84 53.67,25.65 51.94,25.65 51.13,24.84 50.93,24.84 IC2.2 IC2.1
X1-
  Top 0.203: IC2.7 50.93,31.04 52.02,31.04 52.81,30.25 52.96,30.25 R32.2 52.96,30.02 54.59,28.4 55.09,28.4 R24.1
X2
  Top 0.203: R33.1 52.96,24.13 51.43,22.61 49.33,22.61 | 49.33,22.61 49.3,22.61 49.3,24.79 50.47,25.96 50.93,25.96 IC2.3 | 49.33,22.61 49.33,22.63 47.9,21.21 47.9,13.74 47.12,12.95 IC4.7 46.26,12.99 43.94,12.99 R27.2
X+
  Top 0.203: R35.2 55.19,26.57 55.19,26.87 56.01,27.69 56.01,30.73 55.63,31.12 54.91,31.12 47.78,38.25 47.78,38.86 56.21,47.3 58.55,47.3 60.98,49.73 62.1,49.73 X1.1
X-  (via drill 0.33)
  Top 0.203: R24.2 47.37,37.8 47.37,39.06 56.01,47.7 58.14,47.7 58.75,48.31 v58.75,48.51
  Bottom 0.203: v58.75,48.51 62,48.51 X1.14
Y1+
  Top 0.203: R21.1 42.8,30.94 45.24,30.94 45.34,31.04 IC2.8 IC2.9
Y1-
  Top 0.203: R16.1 41.07,25.35 R30.2 41.17,25.35 43,23.52 45.34,23.52 IC2.14
Y2  (via drill 0.33)
  Top 0.203: R31.1 42.8,29.01 44.93,29.01 45.34,28.6 IC2.10 45.34,28.7 48.79,28.7 49.4,29.31 v49.5,29.31 | v50.93,21.89 50.93,18.14 49.3,16.51 49.3,15.8 50.22,14.88 52.76,14.88 52.96,14.68 52.96,12.55 52.15,11.73 51.54,11.73 IC4.1
  Top 0.305: R29.2 48.51,8.55 49.51,8.55 51.47,10.51 51.47,11.66 IC4.1
  Bottom 0.203: v49.5,29.31 50.93,27.89 v50.93,21.89
Y+  (via drill 0.33)
  Top 0.203: v57.84,48.41 56.11,48.41 41.07,33.38 41.07,30.94 R21.2 | X1.2 v59.26,46.99
  Bottom 0.203: v59.26,46.99 v57.84,48.41
Y-  (via drill 0.33)
  Top 0.203: v43.92,28.3 42.8,27.18 R16.2
  Bottom 0.203: v43.92,28.3 43.97,28.3 51.33,35.66 51.33,42.82 54.28,45.77 62.13,45.77 61.92,45.57 62.1,45.57 X1.15

### Text on the board
TallParts: USB | ISP | PWR
ArduinoHoles: 3.2mm | 2.2mm | 3.2mm